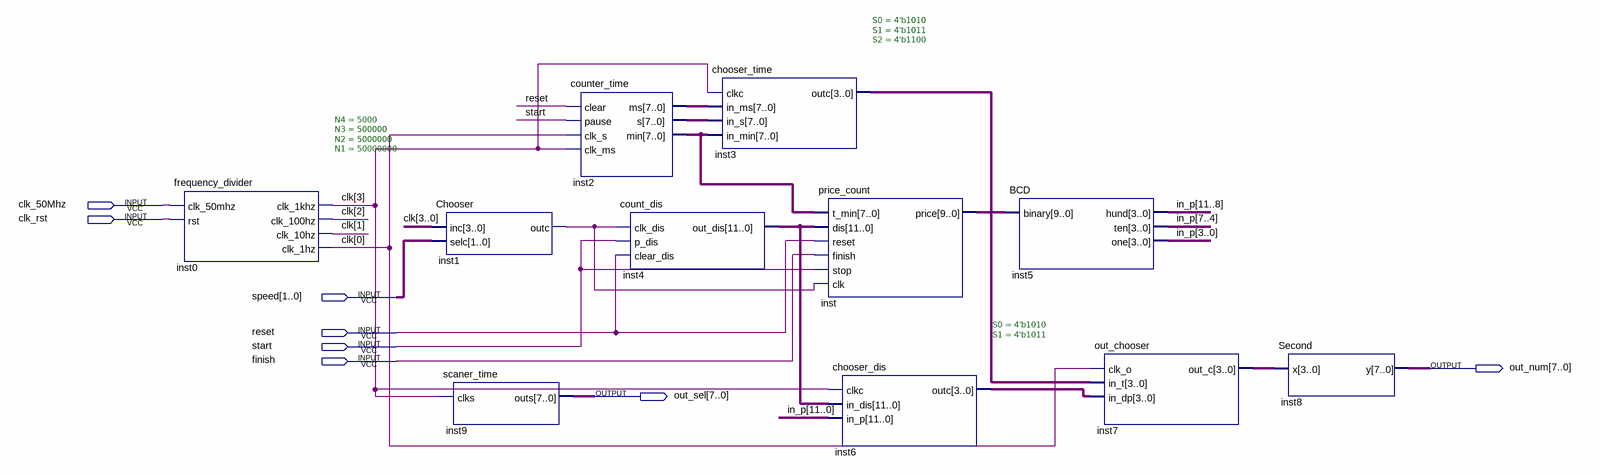
[diagram p0: schematic sheet]
// Quartus schematic final.bdf as structural Verilog: 11 symbols, 8 pins
module \final  (
  input  clk_50Mhz,
  input  clk_rst,
  input  [1:0] speed,
  input  reset,
  input  start,
  input  finish,
  output [7:0] out_num,
  output [7:0] out_sel
);

  wire inst1_outc;
  wire [3:0] clk, inst3_outc, inst6_outc, inst7_out_c;
  wire [7:0] inst2_min, inst2_ms, inst2_s;
  wire [9:0] inst_price;
  wire [11:0] in_p, inst4_out_dis;

  frequency_divider #(.N4(5000), .N3(500000), .N2(5000000), .N1(50000000)) inst0 (
    .clk_50mhz(clk_50Mhz), .rst(clk_rst), .clk_1khz(clk[3]), .clk_100hz(clk[2]), .clk_10hz(clk[1]),
    .clk_1hz(clk[0]));
  Chooser inst1 (.inc(clk), .selc(speed), .outc(inst1_outc));
  scaner_time inst9 (.clks(clk[3]), .outs(out_sel));
  counter_time inst2 (
    .clear(reset), .pause(start), .clk_s(clk[0]), .clk_ms(clk[3]), .ms(inst2_ms), .s(inst2_s), .min(inst2_min));
  count_dis inst4 (.clk_dis(inst1_outc), .p_dis(start), .clear_dis(reset), .out_dis(inst4_out_dis));
  chooser_time #(.S0(4'b1010), .S1(4'b1011), .S2(4'b1100)) inst3 (
    .clkc(clk[3]), .in_ms(inst2_ms), .in_s(inst2_s), .in_min(inst2_min), .outc(inst3_outc));
  price_count inst (
    .t_min(inst2_min), .dis(inst4_out_dis), .reset(reset), .finish(finish), .stop(start), .clk(inst1_outc),
    .price(inst_price));
  chooser_dis #(.S0(4'b1010), .S1(4'b1011)) inst6 (
    .clkc(clk[3]), .in_dis(inst4_out_dis), .in_p(in_p), .outc(inst6_outc));
  BCD inst5 (.binary(inst_price), .hund(in_p[11:8]), .ten(in_p[7:4]), .one(in_p[3:0]));
  out_chooser inst7 (.clk_o(clk[0]), .in_t(inst3_outc), .in_dp(inst6_outc), .out_c(inst7_out_c));
  Second inst8 (.x(inst7_out_c), .y(out_num));
endmodule
